# EAGLE schematic RoverMux (EAGLE 6.4)
DATABASE: /home/mes/eagle/PARTSDB.txt
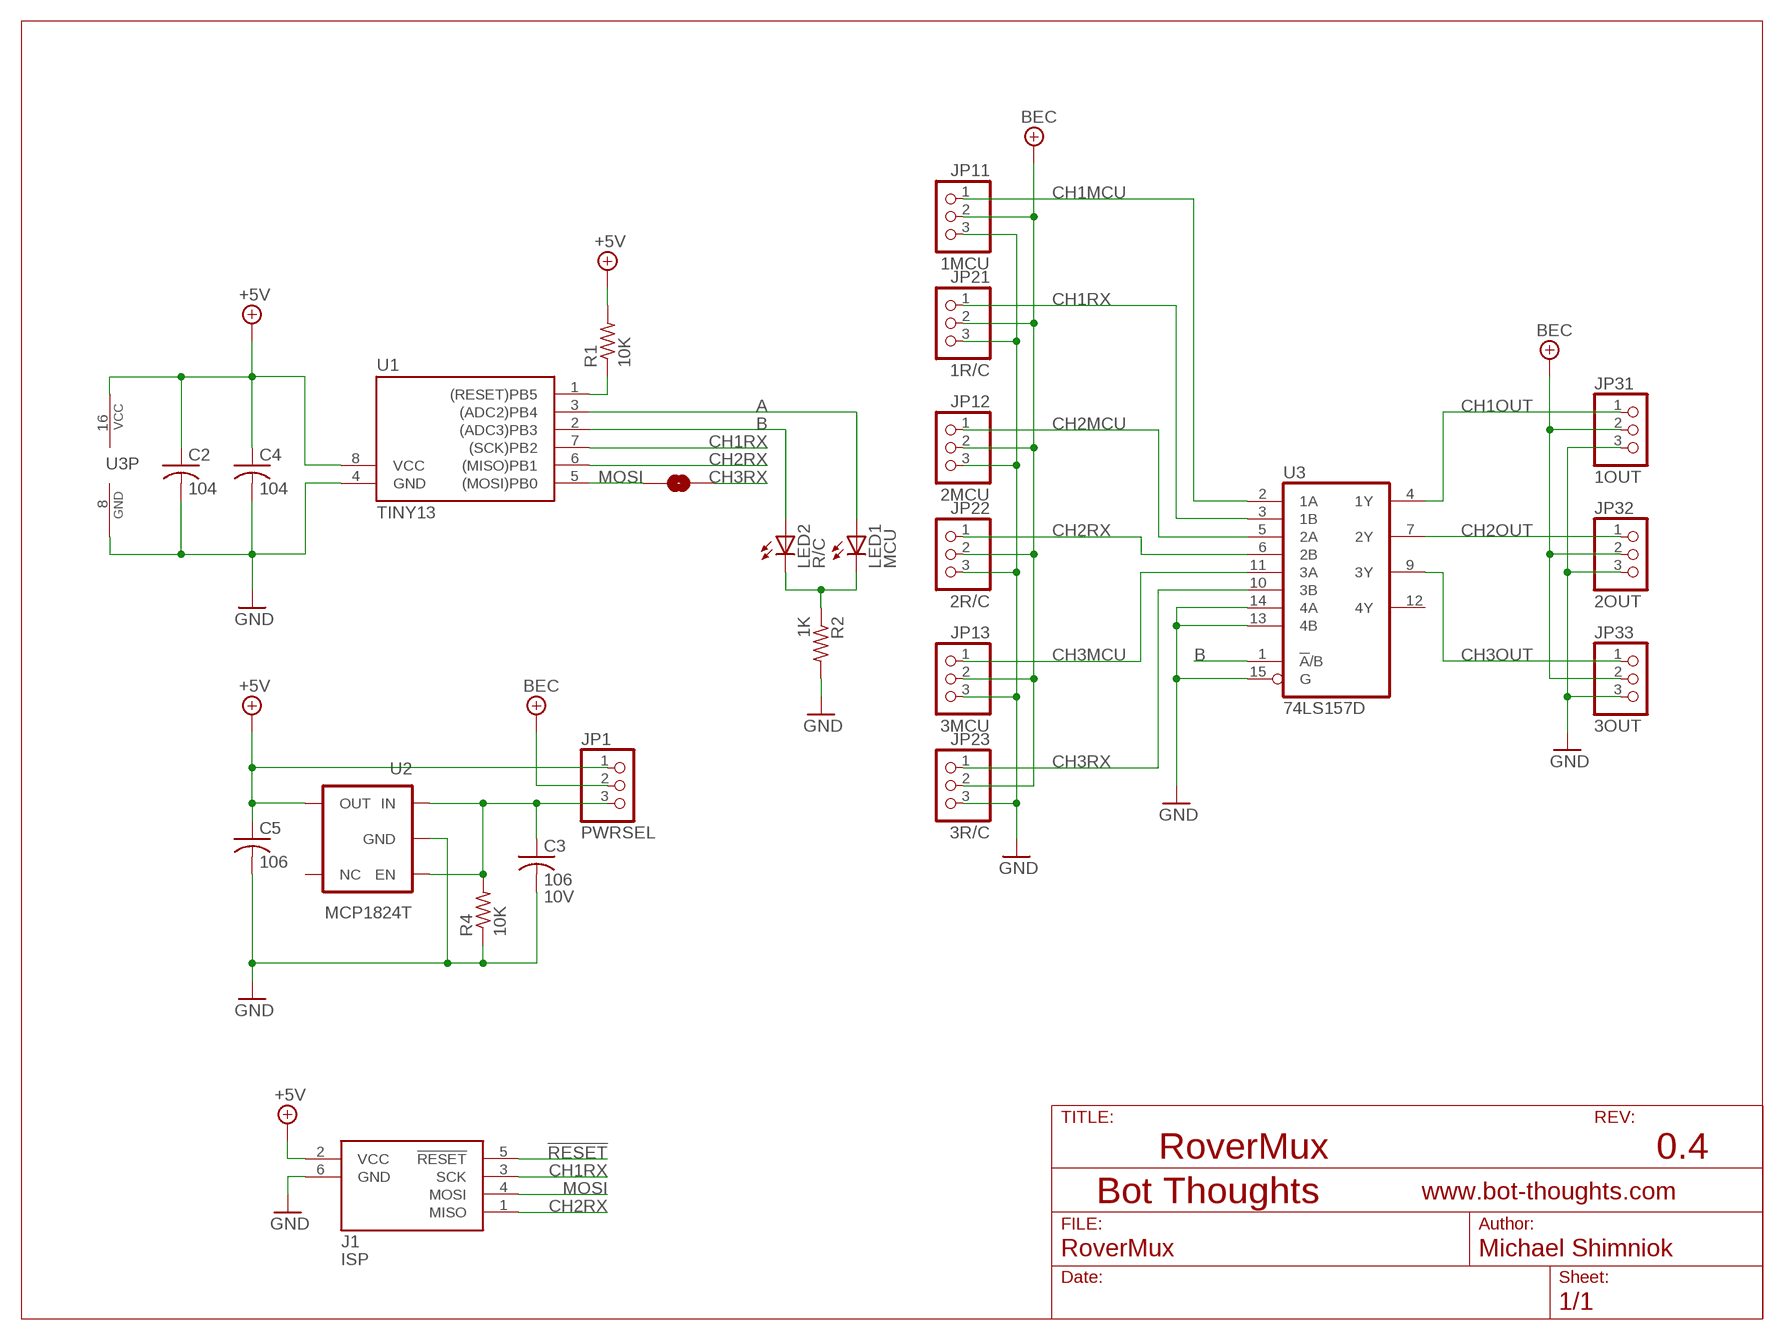
[diagram p0: schematic, sheet 1]

## Parts
C2  104  C-USC0603  [C0603]
C3  106  C-USC0603  [C0603]
C4  104  C-USC0603  [C0603]
C5  106  C-USC0603  [C0603]
J1  ISP  AVRISP6  [CON6P2R]
JP1  PWRSEL  PINHD-1X03_2.00  [1X03M]
JP11  1MCU  PINHD-1X03_2.54-S  [1X03-S]
JP12  2MCU  PINHD-1X03_2.54-S  [1X03-S]
JP13  3MCU  PINHD-1X03_2.54-S  [1X03-S]
JP21  1R/C  PINHD-1X03_2.54-S  [1X03-S]
JP22  2R/C  PINHD-1X03_2.54-S  [1X03-S]
JP23  3R/C  PINHD-1X03_2.54-S  [1X03-S]
JP31  1OUT  PINHD-1X03_2.54-S  [1X03-S]
JP32  2OUT  PINHD-1X03_2.54-S  [1X03-S]
JP33  3OUT  PINHD-1X03_2.54-S  [1X03-S]
LED1  MCU  LEDCHIPLED_1206  [CHIPLED_1206]
LED2  R/C  LEDCHIPLED_1206  [CHIPLED_1206]
R1  10K  R-US_R0603  [R0603]
R2  1K  R-US_R0603  [R0603]
R4  10K  R-US_R0603  [R0603]
SJ1  CH3  SOLDERJUMPERNC2  [SJ_2S-NOTRACE]
U1  TINY13  TINY138S2  [SO08]
U2  MCP1824T  MCP1801  [SOT23-5]
U3  74LS157D  [SO16]

## Nets
!RESET: J1.5(!RESET) R1.1 U1.1((RESET)PB5)
+5V: C2.1 C4.1 C5.1 J1.2(VCC) JP1.1 R1.2 U1.8(VCC) U2.5(OUT) U3.16(VCC)
+7V: JP1.2 JP11.2 JP12.2 JP13.2 JP21.2 JP22.2 JP23.2 JP31.2 JP32.2 JP33.2 ; supply symbol labelled BEC
A: LED1.A U1.3((ADC2)PB4)
B: LED2.A U1.2((ADC3)PB3) U3.1(!A!/B)
CH1MCU: JP11.1 U3.2(1A)
CH1OUT: JP31.1 U3.4(1Y)
CH1RX: J1.3(SCK) JP21.1 U1.7((SCK)PB2) U3.3(1B)
CH2MCU: JP12.1 U3.5(2A)
CH2OUT: JP32.1 U3.7(2Y)
CH2RX: J1.1(MISO) JP22.1 U1.6((MISO)PB1) U3.6(2B)
CH3MCU: JP13.1 U3.11(3A)
CH3OUT: JP33.1 U3.9(3Y)
CH3RX: JP23.1 SJ1.2 U3.10(3B)
GND: C2.2 C3.2 C4.2 C5.2 J1.6(GND) JP11.3 JP12.3 JP13.3 JP21.3 JP22.3 JP23.3 JP31.3 JP32.3 JP33.3 R2.2 R4.1 U1.4(GND) U2.2(GND) U3.8(GND) U3.13(4B) U3.14(4A) U3.15(G)
MOSI: J1.4(MOSI) SJ1.1 U1.5((MOSI)PB0)
N$3: LED1.C LED2.C R2.1
REGIN: C3.1 JP1.3 R4.2 U2.1(IN) U2.3(EN)
Unconnected: U2.4(NC) U3.12(4Y)

## Notes on the sheet
- RoverMux | 0.4

## Library data of the parts
C2 C4 = rcl:C-US: CAPACITOR, American symbol; PARTNO: C1608X7R1E104K080AA
C3 = rcl:C-US: CAPACITOR, American symbol; PARTNO: CL10A106MP8NNNC; VOLTAGE: 10V
C5 = rcl:C-US: CAPACITOR, American symbol; PARTNO: CL10A106MP8NNNC
J1 = bt_avr:AVRISP6: 6-pin dual-row connector for Atmel AVRISP programmer interface
JP1 JP11-JP13 JP21-JP23 JP31-JP33 = pinhead-2:PINHD-1X03: PIN HEADER
LED1 = led:LED: LED OSRAM: - CHIPLED LG R971, LG N971, LY N971, LG Q971, LY Q971, LO R971, LY R971 LH N974, LH R974 LS Q976, LO Q976, LY Q976 LO Q996 - Hyper CHIPLED LW Q18S LB Q993, LB Q99A, LB R99A - SideLED LS A670, LO A670, LY A670, LG A670, LP A670 LB A673, LV A673, LT A673, LW A673 LH A674 LY A675 LS A676, LA A676, LO A676, LY A676, LW A676 LS A679, LY A679, LG A679 - Hyper Micro SIDELED® LS Y876, LA Y876, LO Y876, LY Y876 LT Y87S - SmartLED LW L88C, LW L88S LB L89C, LB L89S, LG L890 LS L89K, LO L89K, LY L89K LS L896, LA L896, LO L896, LY L896 - TOPLED LS T670, LO T670, LY T670, LG T670, LP T670 LSG T670, LSP T670, LSY T670, LOP T670, LYG T670 LG T671, LOG T671, LSG T671 LB T673, LV T673, LT T673, LW T673 LH T674 LS T676, LA T676, LO T676, LY T676, LB T676, LH T676, LSB T676, LW T676 LB T67C, LV T67C, LT T67C, LS T67K, LO T67K, LY T67K, LW E67C LS E67B, LA E67B, LO E67B, LY E67B, LB E67C, LV E67C, LT E67C LW T67C LS T679, LY T679, LG T679 LS T770, LO T770, LY T770, LG T770, LP T770 LB T773, LV T773, LT T773, LW T773 LH T774 LS E675, LA E675, LY E675, LS T675 LS T776, LA T776, LO T776, LY T776, LB T776 LHGB T686 LT T68C, LB T68C - Hyper Mini TOPLED® LB M676 - Mini TOPLED Santana® LG M470 LS M47K, LO M47K, LY M47K Source: http://www.osram.convergy.de LUXEON: - LUMILED® LXK2-PW12-R00, LXK2-PW12-S00, LXK2-PW14-U00, LXK2-PW14-V00 LXK2-PM12-R00, LXK2-PM12-S00, LXK2-PM14-U00 LXK2-PE12-Q00, LXK2-PE12-R00, LXK2-PE12-S00, LXK2-PE14-T00, LXK2-PE14-U00 LXK2-PB12-K00, LXK2-PB12-L00, LXK2-PB12-M00, LXK2-PB14-N00, LXK2-PB14-P00, LXK2-PB14-Q00 LXK2-PR12-L00, LXK2-PR12-M00, LXK2-PR14-Q00, LXK2-PR14-R00 LXK2-PD12-Q00, LXK2-PD12-R00, LXK2-PD12-S00 LXK2-PH12-R00, LXK2-PH12-S00 LXK2-PL12-P00, LXK2-PL12-Q00, LXK2-PL12-R00 Source: www.luxeon.com KINGBRIGHT: KA-3528ASYC Source: www.kingbright.com; PARTNO: LH N974-KN-1
LED2 = led:LED: LED OSRAM: - CHIPLED LG R971, LG N971, LY N971, LG Q971, LY Q971, LO R971, LY R971 LH N974, LH R974 LS Q976, LO Q976, LY Q976 LO Q996 - Hyper CHIPLED LW Q18S LB Q993, LB Q99A, LB R99A - SideLED LS A670, LO A670, LY A670, LG A670, LP A670 LB A673, LV A673, LT A673, LW A673 LH A674 LY A675 LS A676, LA A676, LO A676, LY A676, LW A676 LS A679, LY A679, LG A679 - Hyper Micro SIDELED® LS Y876, LA Y876, LO Y876, LY Y876 LT Y87S - SmartLED LW L88C, LW L88S LB L89C, LB L89S, LG L890 LS L89K, LO L89K, LY L89K LS L896, LA L896, LO L896, LY L896 - TOPLED LS T670, LO T670, LY T670, LG T670, LP T670 LSG T670, LSP T670, LSY T670, LOP T670, LYG T670 LG T671, LOG T671, LSG T671 LB T673, LV T673, LT T673, LW T673 LH T674 LS T676, LA T676, LO T676, LY T676, LB T676, LH T676, LSB T676, LW T676 LB T67C, LV T67C, LT T67C, LS T67K, LO T67K, LY T67K, LW E67C LS E67B, LA E67B, LO E67B, LY E67B, LB E67C, LV E67C, LT E67C LW T67C LS T679, LY T679, LG T679 LS T770, LO T770, LY T770, LG T770, LP T770 LB T773, LV T773, LT T773, LW T773 LH T774 LS E675, LA E675, LY E675, LS T675 LS T776, LA T776, LO T776, LY T776, LB T776 LHGB T686 LT T68C, LB T68C - Hyper Mini TOPLED® LB M676 - Mini TOPLED Santana® LG M470 LS M47K, LO M47K, LY M47K Source: http://www.osram.convergy.de LUXEON: - LUMILED® LXK2-PW12-R00, LXK2-PW12-S00, LXK2-PW14-U00, LXK2-PW14-V00 LXK2-PM12-R00, LXK2-PM12-S00, LXK2-PM14-U00 LXK2-PE12-Q00, LXK2-PE12-R00, LXK2-PE12-S00, LXK2-PE14-T00, LXK2-PE14-U00 LXK2-PB12-K00, LXK2-PB12-L00, LXK2-PB12-M00, LXK2-PB14-N00, LXK2-PB14-P00, LXK2-PB14-Q00 LXK2-PR12-L00, LXK2-PR12-M00, LXK2-PR14-Q00, LXK2-PR14-R00 LXK2-PD12-Q00, LXK2-PD12-R00, LXK2-PD12-S00 LXK2-PH12-R00, LXK2-PH12-S00 LXK2-PL12-P00, LXK2-PL12-Q00, LXK2-PL12-R00 Source: www.luxeon.com KINGBRIGHT: KA-3528ASYC Source: www.kingbright.com; PARTNO: LG N971-KN-1
R1 R4 = rcl:R-US_: RESISTOR, American symbol; PARTNO: 1622829-1
R2 = rcl:R-US_: RESISTOR, American symbol; PARTNO: RC0603JR-07330RL
SJ1 = SparkFun:SOLDERJUMPER: Solder Jumper Standard SMD solder jumper. Used to automate production. Two varients : Normally Open and Normally Closed are the same, but have different paste layers. NC will have a large amount of paste and should jumper during reflow.
U1 = avr-7:TINY13*; PARTNO: ATTINY13A-SSH
U2 = mes_regulators:MCP1801: Microchip MCP1801 LDO Regulator The MCP1801 is a family of CMOS low dropout (LDO) voltage regulators that can deliver up to 150 mA of current while consuming only 25 μA of quiescent current (typical) with input operating range from 2.0V to 10.0V. Datasheet.pdf <http://ww1.microchip.com/downloads/en/DeviceDoc/22051D.pdf>; PARTNO: MCP1824T-5002E/OT
U3 = 74xx-us:74*157: Quadruple 2-line to 1-line data SELECTOR/MULTIPLEXER; PARTNO: 74HCT157D,652